# Altium schematic sheet NANO_STM32F103_1.SchDoc
size A4
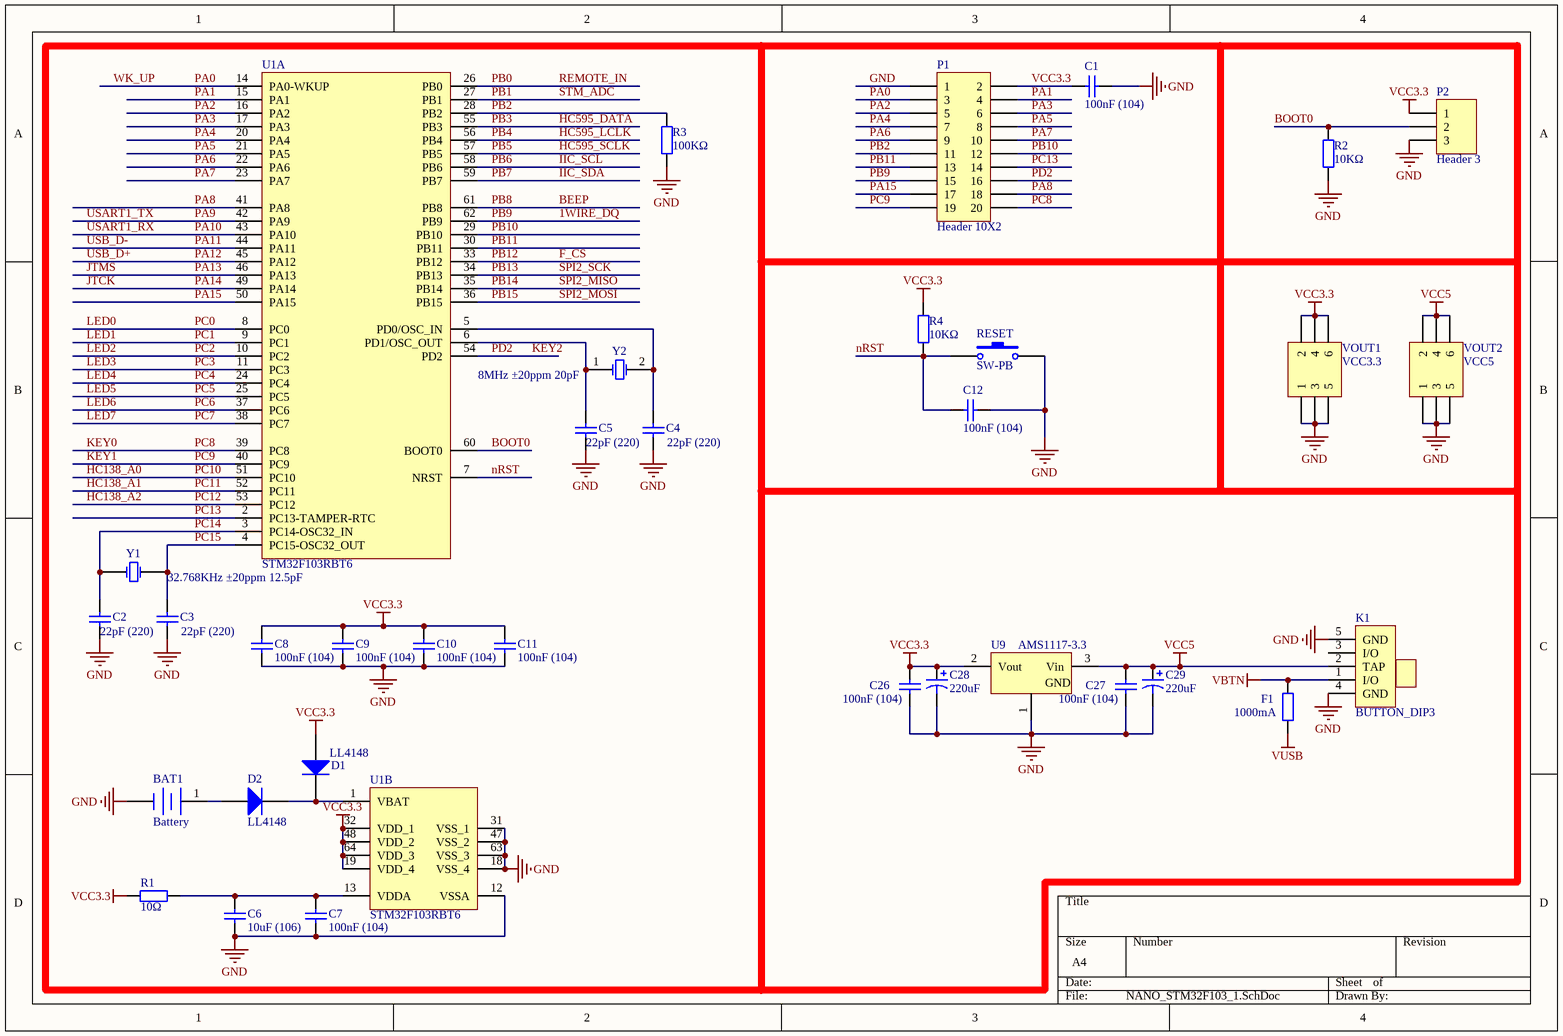
[diagram p0: NANO_STM32F103_1.SchDoc]

## Parts
BAT1  Battery  [BAT-2]
C1  100nF (104)  [0603_C]
C2  22pF (220)  [0603_C]
C3  22pF (220)  [0603_C]
C4  22pF (220)  [0603_C]
C5  22pF (220)  [0603_C]
C6  10uF (106)  [0805_C]
C7  100nF (104)  [0603_C]
C8  100nF (104)  [0603_C]
C9  100nF (104)  [0603_C]
C10  100nF (104)  [0603_C]
C11  100nF (104)  [0603_C]
C12  100nF (104)  [0603_C]
C26  100nF (104)  [0603_C]
C27  100nF (104)  [0603_C]
C28  220uF  [RB7.6-15]
C29  220uF  [RB7.6-15]
D1  LL4148  [LL-34]
D2  LL4148  [LL-34]
F1  1000mA  [0805_R]
K1  BUTTON_DIP3  [SW]
P1  Header 10X2  [HDR2X10]
P2  Header 3  [HDR1X3]
R1  10Ω  [0603_R]
R2  10KΩ  [0603_R]
R3  100KΩ  [0603_R]
R4  10KΩ  [0603_R]
RESET  SW-PB  [SPST-2]
U1  STM32F103RBT6  [LQFP-64_10x10x05P]  (parts A,B of 2)
U9  AMS1117-3.3  [SOT-223]
VOUT1  VCC3.3  [HDR2X3]
VOUT2  VCC5  [HDR2X3]
Y1  32.768KHz ±20ppm 12.5pF  [SMD-3215_2P FC - 135]
Y2  8MHz ±20ppm 20pF  [SMD-5032_2P]

## Nets
GND: BAT1.2(-) C1.1 C2.2 C3.1 C4.1 C5.1 C6.2 C7.2 C8.1 C9.1 C10.1 C11.1 C12.1 C26.1 C27.1 C28.2 C29.2 K1.4(GND) K1.5(GND) P1.1 P2.3 R2.1 R3.1 RESET.2 U1.12(VSSA) U1.18(VSS_4) U1.31(VSS_1) U1.47(VSS_2) U1.63(VSS_3) U9.1(GND) VOUT1.1 VOUT1.3 VOUT1.5 VOUT2.1 VOUT2.3 VOUT2.5
VBTN: F1.2 K1.1(I/O)
VCC3.3: C1.2 C8.2 C9.2 C10.2 C11.2 C26.2 C28.1 D1.1(A) P1.2 P2.1 R1.1 R4.2 U1.19(VDD_4) U1.32(VDD_1) U1.48(VDD_2) U1.64(VDD_3) U9.2(Vout) VOUT1.2 VOUT1.4 VOUT1.6
VCC5: C27.2 C29.1 K1.2(TAP) U9.3(Vin) VOUT2.2 VOUT2.4 VOUT2.6
VUSB: F1.1
1WIRE_DQ: P1.15 U1.62(PB9)  [also labelled PB9]
BEEP: U1.61(PB8)  [also labelled PB8]
BOOT0: P2.2 R2.2 U1.60(BOOT0)
F_CS: U1.33(PB12)  [also labelled PB12]
HC138_A0: U1.51(PC10)  [also labelled PC10]
HC138_A1: U1.52(PC11)  [also labelled PC11]
HC138_A2: U1.53(PC12)  [also labelled PC12]
HC595_DATA: U1.55(PB3)  [also labelled PB3]
HC595_LCLK: U1.56(PB4)  [also labelled PB4]
HC595_SCLK: U1.57(PB5)  [also labelled PB5]
IIC_SCL: U1.58(PB6)  [also labelled PB6]
IIC_SDA: U1.59(PB7)  [also labelled PB7]
JTCK: U1.49(PA14)  [also labelled PA14]
JTMS: U1.46(PA13)  [also labelled PA13]
KEY0: P1.20 U1.39(PC8)  [also labelled PC8]
KEY1: P1.19 U1.40(PC9)  [also labelled PC9]
KEY2: P1.16 U1.54(PD2)  [also labelled PD2]
LED0: U1.8(PC0)  [also labelled PC0]
LED1: U1.9(PC1)  [also labelled PC1]
LED2: U1.10(PC2)  [also labelled PC2]
LED3: U1.11(PC3)  [also labelled PC3]
LED4: U1.24(PC4)  [also labelled PC4]
LED5: U1.25(PC5)  [also labelled PC5]
LED6: U1.37(PC6)  [also labelled PC6]
LED7: U1.38(PC7)  [also labelled PC7]
nRST: C12.2 R4.1 RESET.1 U1.7(NRST)
PA0: P1.3 U1.14(PA0-WKUP)  [also labelled WK_UP]
PA1: P1.4 U1.15(PA1)
PA2: P1.5 U1.16(PA2)
PA3: P1.6 U1.17(PA3)
PA4: P1.7 U1.20(PA4)
PA5: P1.8 U1.21(PA5)
PA6: P1.9 U1.22(PA6)
PA7: P1.10 U1.23(PA7)
PA8: P1.18 U1.41(PA8)
PA9: U1.42(PA9)  [also labelled USART1_TX]
PA10: U1.43(PA10)  [also labelled USART1_RX]
PA11: U1.44(PA11)  [also labelled USB_D-]
PA12: U1.45(PA12)  [also labelled USB_D+]
PA15: P1.17 U1.50(PA15)
PB0: U1.26(PB0)  [also labelled REMOTE_IN]
PB1: U1.27(PB1)  [also labelled STM_ADC]
PB2: P1.11 R3.2 U1.28(PB2)
PB10: P1.12 U1.29(PB10)
PB11: P1.13 U1.30(PB11)
PB13: U1.34(PB13)  [also labelled SPI2_SCK]
PB14: U1.35(PB14)  [also labelled SPI2_MISO]
PB15: U1.36(PB15)  [also labelled SPI2_MOSI]
PC13: P1.14 U1.2(PC13-TAMPER-RTC)
PC14: C2.1 U1.3(PC14-OSC32_IN) Y1.2(OSC2)
PC15: C3.2 U1.4(PC15-OSC32_OUT) Y1.1(OSC1)
NetBAT1_1: BAT1.1(+) D2.1(A)
NetC4_2: C4.2 U1.5(PD0/OSC_IN) Y2.2(OSC2)
NetC5_2: C5.2 U1.6(PD1/OSC_OUT) Y2.1(OSC1)
NetC6_1: C6.1 C7.1 R1.2 U1.13(VDDA)
NetD1_2: D1.2(K) D2.2(K) U1.1(VBAT)

Not connected (* = marked no-connect by the designer): K1 3(I/O)

## Library data of the parts
BAT1 = Battery: Multicell Battery; Published: 24-Mar-1999; LatestRevisionDate: 17-Jul-2002; LatestRevisionNote: Re-released for DXP Platform.; PackageReference: BAT-2; Publisher: Altium Limited; PackageDescription: Battery; 2 Leads
C1 C7-C12 C26 C27 = 0603 100nF (104) 10% 50V: 贴片电容; ComponentLink1Description: 供应商链接; ComponentLink1URL: http://www.szlcsc.com/product/details_15331.html; Package: 0603; Supplier: LC; SuppliersPartNumber: C14663
C2-C5 = 0603 22pF (220) 5% 50V: 贴片电容; ComponentLink1Description: 供应商链接; ComponentLink1URL: http://www.szlcsc.com/product/details_2005.html; Package: 0603; Supplier: LC; SuppliersPartNumber: C1653
C6 = 0805 10uF (106) 10% 25V: 贴片电容; ComponentLink1Description: 供应商链接; ComponentLink1URL: http://www.szlcsc.com/product/details_16532.html; Package: 0805; Supplier: LC; SuppliersPartNumber: C15850
C28 C29 = Cap Pol1: 电解电容; Value: 100pF; Published: 8-Jun-2000; LatestRevisionDate: 17-Jul-2002; LatestRevisionNote: Re-released for DXP Platform.; PackageReference: RB7.6-15; Publisher: Altium Limited; PackageDescription: Polarized Capacitor (Radial); 2 Leads
D1 D2 = LL-34 LL4148 LL-34 1206: 开关二极管; ComponentLink1Description: 供应商链接; ComponentLink1URL: http://www.szlcsc.com/product/details_10338.html; Package: LL-34; Supplier: LC; SuppliersPartNumber: C9808
F1 = 0805 1KΩ (1001) 1%: 自恢复保险丝; ComponentLink1Description: 供应商链接; ComponentLink1URL: http://www.szlcsc.com/product/details_18201.html; Package: 0805; Supplier: LC; SuppliersPartNumber: C17513
K1 = BUTTON_DIP3: 拨动开关
P1 = Header 10X2: Header, 10-Pin, Dual row; LatestRevisionDate: 17-Jul-2002; LatestRevisionNote: Re-released for DXP Platform.; Publisher: Altium Limited
P2 = Header 3: Header, 3-Pin; LatestRevisionDate: 17-Jul-2002; LatestRevisionNote: Re-released for DXP Platform.; Publisher: Altium Limited
R1 = 0603 10Ω (10R0) 1%: 贴片电阻; ComponentLink1Description: 供应商链接; ComponentLink1URL: http://www.szlcsc.com/product/details_23586.html; Package: 0603; Supplier: LC; SuppliersPartNumber: C22859
R2 R4 = 0603 10KΩ (1002) 1%: 贴片电阻; ComponentLink1Description: 供应商链接; ComponentLink1URL: http://www.szlcsc.com/product/details_26547.html; Package: 0603; Supplier: LC; SuppliersPartNumber: C25804
R3 = 0603 100KΩ (1003) 1%: 贴片电阻; ComponentLink1Description: 供应商链接; ComponentLink1URL: http://www.szlcsc.com/product/details_26546.html; Package: 0603; Supplier: LC; SuppliersPartNumber: C25803
RESET = SW-PB: RESET; Published: 24-Mar-1999; LatestRevisionDate: 17-Jul-2002; LatestRevisionNote: Re-released for DXP Platform.; PackageReference: SPST-2; Publisher: Altium Limited; PackageDescription: Switch; 2 Leads
U1 = STM32F103RBT6: ARM; ComponentLink1Description: 供应商链接; ComponentLink1URL: http://www.szlcsc.com/product/details_9244.html; Package: LQFP-64_10x10x05P; Supplier: LC; SuppliersPartNumber: C8735
U9 = SOT-223 AMS1117-3.3: 低压差线性稳压(LDO); ComponentLink1Description: 供应商链接; ComponentLink1URL: http://www.szlcsc.com/product/details_6652.html; Package: SOT-223; Supplier: LC; SuppliersPartNumber: C6186
VOUT1 VOUT2 = Header 3X2: Header, 3-Pin, Dual row; LatestRevisionDate: 17-Jul-2002; LatestRevisionNote: Re-released for DXP Platform.; Publisher: Altium Limited
Y1 = SMD-3215_2P 32.768KHz 20ppm 12.5pF: 贴片晶振; ComponentLink1Description: 供应商链接; ComponentLink1URL: http://www.szlcsc.com/product/details_33310.html; Package: SMD-3215_2P; Supplier: LC; SuppliersPartNumber: C32346
Y2 = SMD-5032_2P 8MHz 20ppm 20pF: 贴片晶振; ComponentLink1Description: 供应商链接; ComponentLink1URL: http://www.szlcsc.com/product/details_117214.html; Package: SMD-5032_2P; Supplier: LC; SuppliersPartNumber: C115962